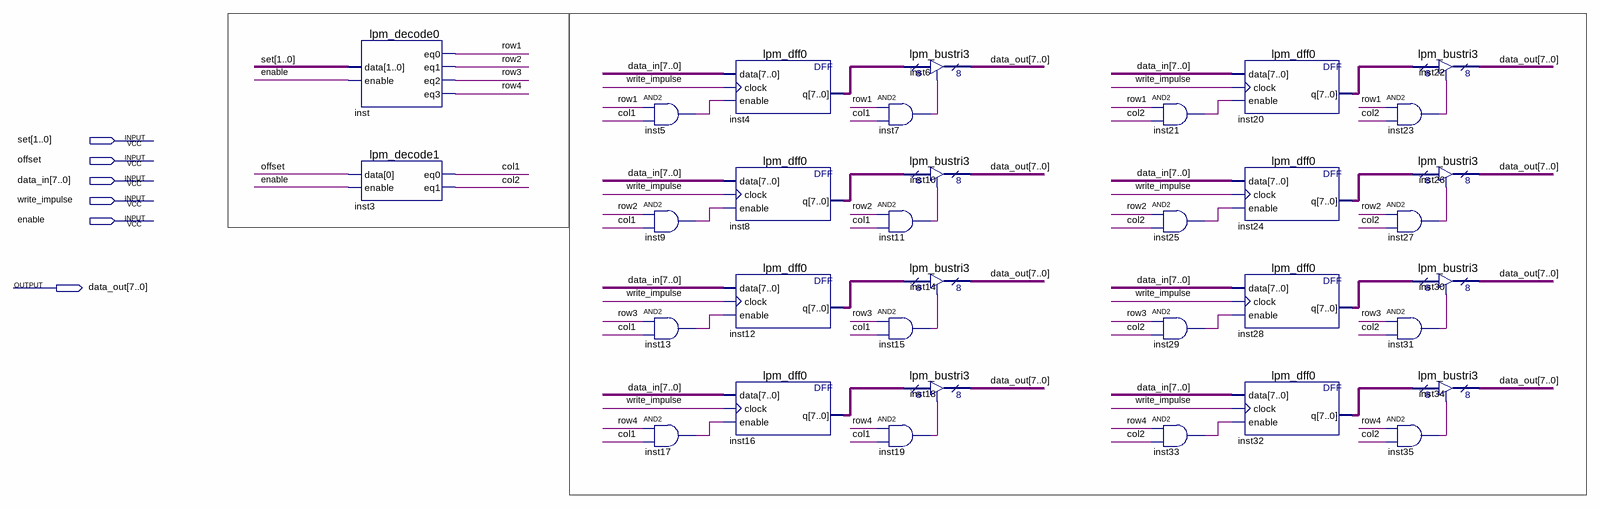
[diagram p0: schematic sheet]
// Quartus schematic CacheMemoryBlock.bdf as structural Verilog: 34 symbols, 6 pins
module CacheMemoryBlock (
  input  [1:0] set,
  input  offset,
  input  [7:0] data_in,
  input  write_impulse,
  input  enable,
  output [7:0] data_out
);

  wire col1, col2, inst5_out, inst7_out, inst9_out, inst11_out, inst13_out, inst15_out, inst17_out,
       inst19_out, inst21_out, inst23_out, inst25_out, inst27_out, inst29_out, inst31_out, inst33_out,
       inst35_out, row1, row2, row3, row4;
  wire [7:0] inst4_q, inst8_q, inst12_q, inst16_q, inst20_q, inst24_q, inst28_q, inst32_q;

  lpm_decode0 inst (.data(set), .enable(enable), .eq0(row1), .eq1(row2), .eq2(row3), .eq3(row4));
  lpm_decode1 inst3 (.data(offset), .enable(enable), .eq0(col1), .eq1(col2));
  and inst5 (inst5_out, row1, col1);
  and inst9 (inst9_out, row2, col1);
  and inst13 (inst13_out, row3, col1);
  and inst17 (inst17_out, row4, col1);
  lpm_dff0 inst4 (.data(data_in), .clock(write_impulse), .enable(inst5_out), .q(inst4_q));
  lpm_dff0 inst8 (.data(data_in), .clock(write_impulse), .enable(inst9_out), .q(inst8_q));
  lpm_dff0 inst12 (.data(data_in), .clock(write_impulse), .enable(inst13_out), .q(inst12_q));
  lpm_dff0 inst16 (.data(data_in), .clock(write_impulse), .enable(inst17_out), .q(inst16_q));
  lpm_bustri3 inst6 (.enabledt(inst7_out), .data(inst4_q), .tridata(data_out));
  and inst7 (inst7_out, row1, col1);
  lpm_bustri3 inst10 (.enabledt(inst11_out), .data(inst8_q), .tridata(data_out));
  and inst11 (inst11_out, row2, col1);
  lpm_bustri3 inst14 (.enabledt(inst15_out), .data(inst12_q), .tridata(data_out));
  and inst15 (inst15_out, row3, col1);
  lpm_bustri3 inst18 (.enabledt(inst19_out), .data(inst16_q), .tridata(data_out));
  and inst19 (inst19_out, row4, col1);
  and inst21 (inst21_out, row1, col2);
  and inst25 (inst25_out, row2, col2);
  and inst29 (inst29_out, row3, col2);
  and inst33 (inst33_out, row4, col2);
  lpm_dff0 inst20 (.data(data_in), .clock(write_impulse), .enable(inst21_out), .q(inst20_q));
  lpm_dff0 inst24 (.data(data_in), .clock(write_impulse), .enable(inst25_out), .q(inst24_q));
  lpm_dff0 inst28 (.data(data_in), .clock(write_impulse), .enable(inst29_out), .q(inst28_q));
  lpm_dff0 inst32 (.data(data_in), .clock(write_impulse), .enable(inst33_out), .q(inst32_q));
  and inst23 (inst23_out, row1, col2);
  and inst27 (inst27_out, row2, col2);
  and inst31 (inst31_out, row3, col2);
  and inst35 (inst35_out, row4, col2);
  lpm_bustri3 inst22 (.enabledt(inst23_out), .data(inst20_q), .tridata(data_out));
  lpm_bustri3 inst26 (.enabledt(inst27_out), .data(inst24_q), .tridata(data_out));
  lpm_bustri3 inst30 (.enabledt(inst31_out), .data(inst28_q), .tridata(data_out));
  lpm_bustri3 inst34 (.enabledt(inst35_out), .data(inst32_q), .tridata(data_out));
endmodule
